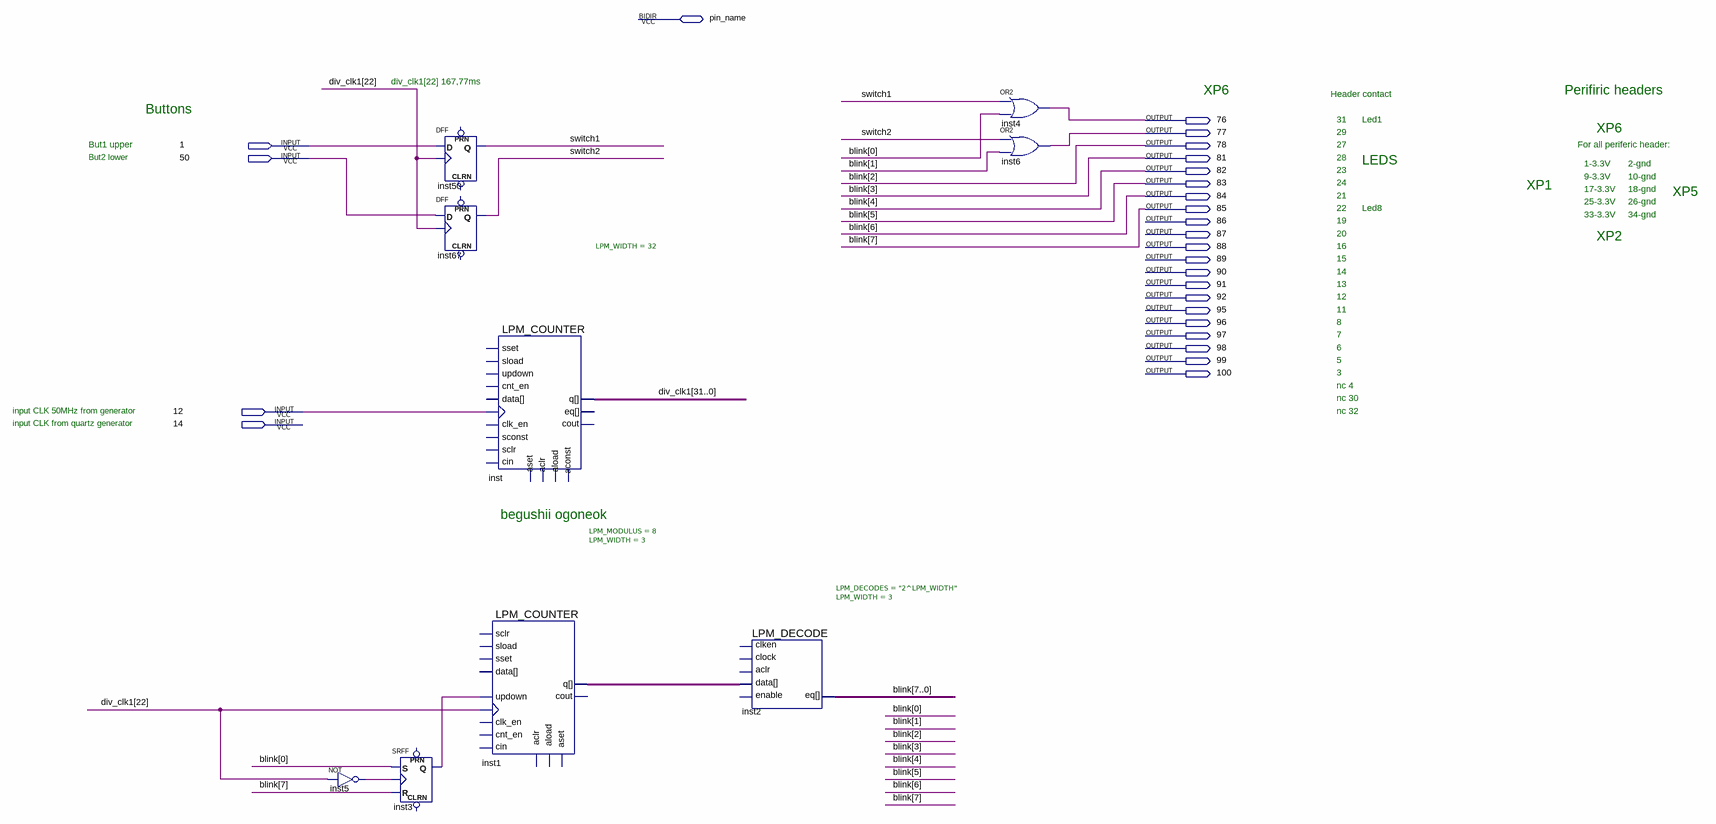
[diagram p0: schematic sheet]
// Quartus schematic Qua_BRD_EPM240T100I5N.bdf as structural Verilog: 9 symbols, 26 pins
module Qua_BRD_EPM240T100I5N (
  input  \1 ,
  input  \50 ,
  input  \12 ,
  input  \14 ,
  inout  pin_name,
  output \76 ,
  output \77 ,
  output \78 ,
  output \81 ,
  output \82 ,
  output \83 ,
  output \84 ,
  output \85 ,
  output \86 ,
  output \87 ,
  output \88 ,
  output \89 ,
  output \90 ,
  output \91 ,
  output \92 ,
  output \95 ,
  output \96 ,
  output \97 ,
  output \98 ,
  output \99 ,
  output \100 
);

  wire inst3_q, inst5_out, switch1, switch2;
  wire [1:0] blink;
  wire [2:0] inst1_q;
  wire [31:0] div_clk1;

  not inst5 (inst5_out, div_clk1[22]);
  SRFF inst3 (.S(blink[0]), .R(\85 ), .CLK(inst5_out), .Q(inst3_q));  // open: PRN, CLRN
  DFF inst50 (.CLK(div_clk1[22]), .D(\1 ), .Q(switch1));  // open: CLRN, PRN
  DFF inst67 (.CLK(div_clk1[22]), .D(\50 ), .Q(switch2));  // open: CLRN, PRN
  LPM_COUNTER #(.LPM_WIDTH(32)) inst (
    .clock(\12 ), .q(div_clk1));  // open: sset, sload, updown, cnt_en, data, clk_en, sconst, sclr, aload, aclr, aset, aconst, cin, eq, cout
  LPM_COUNTER #(.LPM_MODULUS(8), .LPM_WIDTH(3)) inst1 (
    .clock(div_clk1[22]), .updown(inst3_q), .q(inst1_q));  // open: sload, data, clk_en, aload, aclr, aset, cin, sset, cnt_en, sclr, cout
  LPM_DECODE #(.LPM_DECODES("2^LPM_WIDTH"), .LPM_WIDTH(3)) inst2 (
    .data(inst1_q), .eq({\85 , \84 , \83 , \82 , \81 , \78 , blink}));  // open: enable, clken, clock, aclr
  or inst4 (\76 , switch1, blink[0]);
  or inst6 (\77 , switch2, blink[1]);

  // Other names for the same wires on the sheet: blink[7:2] = {\85 , \84 , \83 , \82 , \81 , \78 }

  // Notes on the sheet:
  //   div_clk1[22] 167,77ms
  //   XP6
  //   Perifiric headers
  //   Header contact
  //   Buttons
  //   31
  //   Led1
  //   XP6
  //   29
  //   But1 upper
  //   27
  //   For all periferic header:
  //   But2 lower
  //   28
  //   LEDS
  //   1-3.3V
  //   2-gnd
  //   23
  //   9-3.3V
  //   10-gnd
  //   24
  //   XP1
  //   17-3.3V
  //   18-gnd
  //   XP5
  //   21
  //   25-3.3V
  //   26-gnd
  //   22
  //   Led8
  //   33-3.3V
  //   34-gnd
  //   19
  //   20
  //   XP2
  //   16
  //   15
  //   14
  //   13
  //   12
  //   11
  //   8
  //   7
  //   6
  //   5
  //   3
  //   nc 4
  //   nc 30
  //   input CLK 50MHz from generator
  //   nc 32
  //   input CLK from quartz generator
  //   begushii ogoneok
endmodule
